# Altium project foxbms2-master.PrjPcb (part 1 of 7)
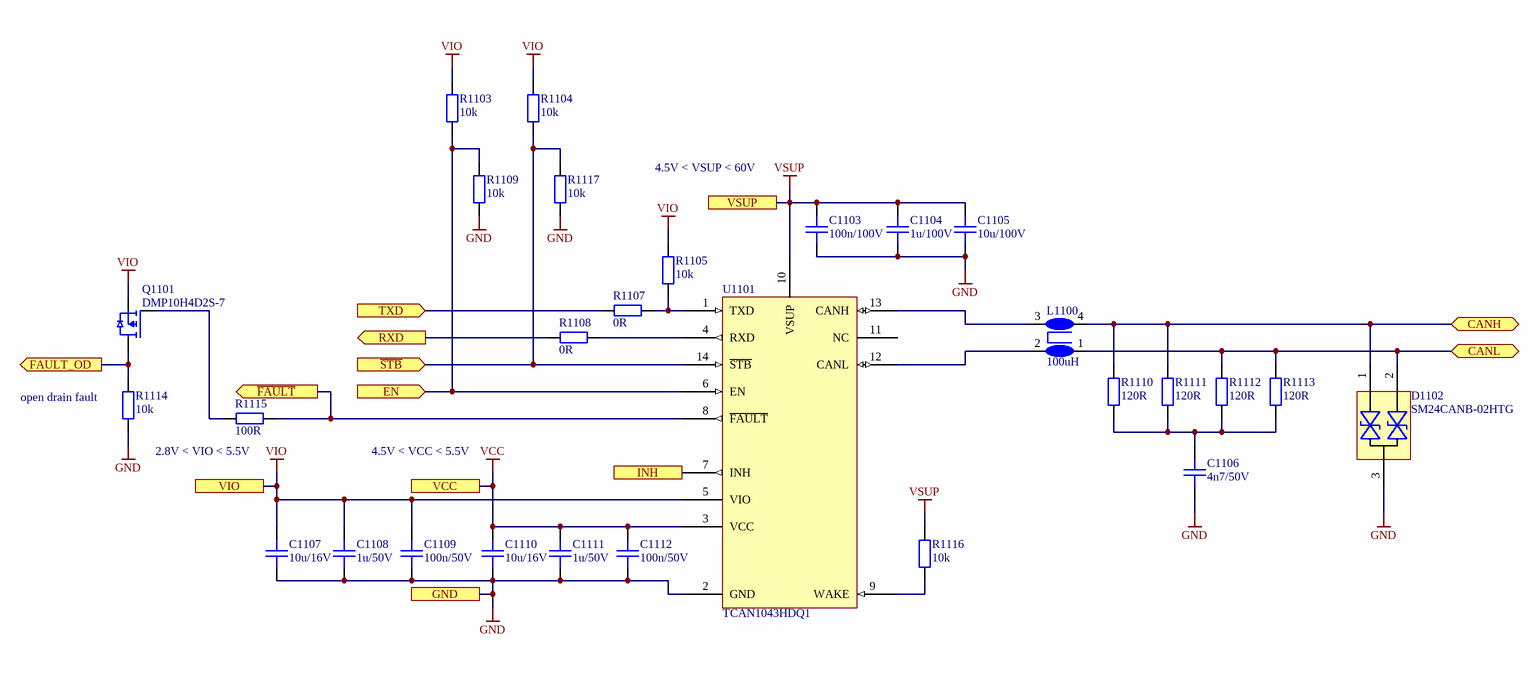
[diagram p0: can-transceiver.SchDoc]
Global_Major_Minor_Patch_Version: 1.2.3; Global_Suffix_Version: 0; GlobalDate: 2025-03-28; GlobalLicense: Creative Commons Attribution 4.0; GlobalProject: foxBMS 2 Master; GlobalVersion: ='v'+Global_Major_Minor_Patch_Version+'-'+Global_Suffix_Version
24 sheets, 379 parts. Net scope: strictly hierarchical (ports join the sheet entries above them; power ports are local).
Board file: foxbms2-master.PcbDoc
Sheets:
  can-transceiver.SchDoc
  ethernet-phy.SchDoc
  oscillator-20MHz.SchDoc
  smart-switch.SchDoc
  connectors-external-old.SchDoc
  foxbms2-master.SchDoc
    mcu = mcu.SchDoc
      mcu-com-gpio-tim = mcu-com-gpio-tim.SchDoc
      mcu-emif-etm-dmm = mcu-emif-etm-dmm.SchDoc
      mcu-adc = mcu-adc.SchDoc
    connectors-external = connectors-external.SchDoc
    connectors-internal = connectors-internal.SchDoc
    communication = communication.SchDoc
    peripherals = peripherals.SchDoc
      window-watchdog = window-watchdog.SchDoc
      rtc = rtc.SchDoc
    io-devices = io-devices.SchDoc
    supply = supply.SchDoc
      sbcs = sbcs.SchDoc
        sbc-mcu = sbc-base.SchDoc
    io-matrix = io-matrix.SchDoc
    interlock = interlock.SchDoc
    connectors-interface = connectors-interface.SchDoc
    connectors-extension = connectors-extension.SchDoc

## Sheet can-transceiver.SchDoc
size A3; DocumentNumber: 4; SheetNumber: 4; SheetTotal: 45; SheetDescription: CAN Transceiver

### Parts
C1103  100n/100V  [CAPC1608X08N]
C1104  1u/100V  [CAPC3216X18N]
C1105  10u/100V  [CAPC5750X28N]
C1106  4n7/50V  [CAPC1005X06N]
C1107  10u/16V  [CAPC2012X14N]
C1108  1u/50V  [CAPC1608X08N]
C1109  100n/50V  [CAPC1005X06N]
C1110  10u/16V  [CAPC2012X14N]
C1111  1u/50V  [CAPC1608X08N]
C1112  100n/50V  [CAPC1005X06N]
D1102  SM24CANB-02HTG  [LF_SOT23-3]
L1100  100uH  [MURATA_DLW32SH]
Q1101  DMP10H4D2S-7  [SOT95P237X110-3N]
R1103  10k  [RESC1005X04N]
R1104  10k  [RESC1005X04N]
R1105  10k  [RESC1005X04N]
R1107  0R  [RESC1005X04N]
R1108  0R  [RESC1005X04N]
R1109  10k  [RESC1005X04N]
R1110  120R  [RESC3216X06N]
R1111  120R  [RESC3216X06N]
R1112  120R  [RESC3216X06N]
R1113  120R  [RESC3216X06N]
R1114  10k  [RESC1005X04N]
R1115  100R  [RESC1005X04N]
R1116  10k  [RESC1005X04N]
R1117  10k  [RESC1005X04N]
U1101  TCAN1043HDQ1  [TI_D0014A-C01_SOIC-14]

### Ports
CANH (bidir), CANL (bidir), EN (in), FAULT_OD (out), GND, INH, RXD (out), TXD (in), VCC, VIO, VSUP, ~{FAULT} (out), ~{STB} (in)

### Nets
GND: C1103.1 C1104.1 C1105.1 C1106.1 C1107.1 C1108.1 C1109.1 C1110.1 C1111.1 C1112.1 D1102.3 R1109.1 R1114.1 R1117.1 U1101.2(GND) ; port GND
VCC: C1110.2 C1111.2 C1112.2 U1101.3(VCC) ; port VCC
VIO: C1107.2 C1108.2 C1109.2 Q1101.S R1103.2 R1104.2 R1105.2 U1101.5(VIO) ; port VIO
VSUP: C1103.2 C1104.2 C1105.2 R1116.2 U1101.10(VSUP) ; port VSUP
NetC1106_2: C1106.2 R1110.1 R1111.1 R1112.1 R1113.1
NetD1102_1: D1102.1 L1100.4 R1110.2 R1111.2 ; port CANH
NetD1102_2: D1102.2 L1100.1 R1112.2 R1113.2 ; port CANL
NetL1100_2: L1100.2 U1101.12(CANL)
NetL1100_3: L1100.3 U1101.13(CANH)
NetQ1101_D: Q1101.D R1114.2 ; port FAULT_OD
NetQ1101_G: Q1101.G R1115.1
NetR1103_1: R1103.1 R1109.2 U1101.6(EN) ; port EN
NetR1104_1: R1104.1 R1117.2 U1101.14(~{STB}) ; port ~{STB}
NetR1105_1: R1105.1 R1107.2 U1101.1(TXD)
NetR1107_1: R1107.1 ; port TXD
NetR1108_1: R1108.1 ; port RXD
NetR1108_2: R1108.2 U1101.4(RXD)
NetR1115_2: R1115.2 U1101.8(~{FAULT}) ; port ~{FAULT}
NetR1116_1: R1116.1 U1101.9(WAKE)
NetU1101_7: U1101.7(INH) ; port INH

Not connected (* = marked no-connect by the designer): U1101 11(NC)

### Notes on the sheet
- 4.5V < VSUP < 60V
- (near R1114) open drain fault
- 2.8V < VIO < 5.5V
- 4.5V < VCC < 5.5V
- Fraunhofer IISB
- Schottkystr. 10
- developed by:
- 91058 Erlangen
- Germany
- Author
- Project
- License
- Description
- File
- Version
- Release Date
- Sheet
- foxbms.org <https://foxbms.org>
- www.iisb.fraunhofer.de <https://www.iisb.fraunhofer.de/>
- foxBMS Team
- /

### Library data of the parts
C1103 = gen_C_ceramic_100n_100V_X7R_0603: MLCC; Capacitance: 100n; Rated Voltage: 100V; Dielectric: X7R; Case EIA: 0603; Case Metric: 1608; Automotive Qualified: True; PnP Package: 0603C; Part Number: gen_C_ceramic_100n_100V_X7R_0603; Supplier 1: Digikey; Supplier Part Number 1: 490-13420-1-ND; Supplier 2: Mouser; Supplier Part Number 2: 81-GCJ188R72A104KA1D
C1104 = gen_C_ceramic_1u_100V_X7R_1206: MLCC; Capacitance: 1u; Rated Voltage: 100V; Dielectric: X7R; Case EIA: 1206; Case Metric: 3216; AVT Set: x; Automotive Qualified: True; Part Number: gen_C_ceramic_1u_100V_X7R_1206; Supplier 1: Farnell; Supplier Part Number 1: 1833855
C1105 = gen_C_ceramic_10u_100V_X7S_2220: MLCC; Capacitance: 10u; Rated Voltage: 100V; Dielectric: X7S; Case EIA: 2220; Case Metric: 5750; Automotive Qualified: True; AEC-Q Grade: Grade 0; AEC-Q Norm: AEC-Q200; Part Number: gen_C_ceramic_10u_100V_X7S_2220; Supplier 1: Digikey; Supplier Part Number 1: 445-13152-1-ND; ECCN: EAR99
C1106 = gen_C_ceramic_4n7_50V_X7R_0402: MLCC; Capacitance: 4n7; Rated Voltage: 50V; Dielectric: X7R; Case EIA: 0402; Case Metric: 1005; Automotive Qualified: True; AEC-Q Grade: Grade 1; AEC-Q Norm: AEC-Q200; PnP Package: 0402C; Part Number: gen_C_ceramic_4n7_50V_X7R_0402; ECCN: EAR99; Supplier 1: Digikey; Supplier Part Number 1: 490-14739-1-ND
C1107 C1110 = gen_C_ceramic_10u_16V_X7R_0805: MLCC; Capacitance: 10u; Rated Voltage: 16V; Dielectric: X7S; Case EIA: 0805; Case Metric: 2012; Automotive Qualified: True; AEC-Q Grade: Grade 1; AEC-Q Norm: AEC-Q200; Part Number: gen_C_ceramic_10u_16V_X7R_0805; ECCN: EAR99; Supplier 1: Digikey; Supplier Part Number 1: 445-16110-1-ND
C1108 C1111 = gen_C_ceramic_1u_50V_X7R_0603: MLCC; Capacitance: 1u; Rated Voltage: 50V; Dielectric: X7R; Case EIA: 0603; Case Metric: 1608; Automotive Qualified: False; Tolerance: ± 10%; PnP Package: 0603C; Part Number: gen_C_ceramic_1u_50V_X7R_0603; Operating Temperature: -55°C - +125°C; Supplier 1: Farnell; Supplier Part Number 1: 2779055
C1109 C1112 = gen_C_ceramic_100n_50V_X7R_0402: MLCC; Capacitance: 100n; Rated Voltage: 50V; Dielectric: X7R; Case EIA: 0402; Case Metric: 1005; PnP Package: 0402C; PnP Value: 100nF/50V/X7R; PnP equipped: x; Automotive Qualified: True; AEC-Q Norm: AEC-Q200; Part Number: gen_C_ceramic_100n_50V_X7R_0402; Supplier 1: Farnell; Supplier Part Number 1: 2210822; ECCN: EAR99
D1102 = SM24CANB-02HTG: CAN ESD Protection Diode Array; Manufacturer: Littelfuse; Automotive Qualified: True; Part Number: SM24CANB-02HTG; Part Name: SM24CANB-02HTG; Operating Temperature: -40°C - +125°C; ComponentLink1Description: Datasheet; ComponentLink1URL: https://www.littelfuse.com/~/media/electronics/datasheets/tvs_diode_arrays/littelfuse_tvs_diode_array_sm24canb_datasheet.pdf.pdf; Supplier 1: Digikey; Supplier Part Number 1: F6707CT-ND
L1100 = DLW32SH101XF2L: Common Mode Choke; Manufacturer: Murata; Rated Current: 0.115A; Automotive Qualified: True; AEC-Q Norm: AEC-Q200; Part Number: DLW32SH101XF2L; Operating Temperature: –40°C - +125°C; ComponentLink1Description: Datasheet; ComponentLink1URL: https://4donline.ihs.com/images/VipMasterIC/IC/MURE/MURE-S-A0010901825/MURE-S-A0010900222-1.pdf?hkey=6D3A4C79FDBF58556ACFDE234799DDF0; Inductance: 100uH; Supplier 1: Farnell; Supplier Part Number 1: 3639227
Q1101 = DMP10H4D2S-7: MOSFET-Transistor, p-Kanal, 0.27 A, 100 V, 4.2 ohm; Manufacturer: Diodes; Maximum Drain-Source Voltage: 100V; Maximum Continous Drain Current (25°C): 0.27A; R_DS(on): 4.2; Total Gate Charge: 1.8nC; Automotive Qualified: True; Part Number: DMP10H4D2S-7; Part Name: PMOS; Operating Temperature: -55°C - +150°C; ComponentLink1Description: Datasheet; ComponentLink1URL: https://www.diodes.com/assets/Datasheets/DMP10H4D2S.pdf; Supplier 1: Farnell; Supplier Part Number 1: 3127354; Supplier 2: Digikey; Supplier Part Number 2: DMP10H4D2S-7DICT-ND; Supplier 3: Mouser; Supplier Part Number 3: 621-DMP10H4D2S-7
R1103-R1105 R1109 R1114 R1117 = gen_R_10k_0402: SMD Resistor 10k 0402; Tolerance: 1%; Power: 0.063W; Case EIA: 0402; Case Metric: 1005; Maximum Working Voltage: 50V; PnP Package: 0402R; PnP equipped: x; Automotive Qualified: True; AEC-Q Norm: AEC-Q200; Part Number: gen_R_10k_0402; Operating Temperature: -55°C - +155°C; Resistance: 10k; Series: E24, E96; PnP Value: 10k; Supplier 1: Farnell; Supplier Part Number 1: 2059239; ECCN: EAR99
R1107 R1108 = gen_R_0R_0402: SMD Resistor 0R 0402; Power: 0.063W; Case EIA: 0402; Case Metric: 1005; Maximum Working Voltage: 50V; PnP Package: 0402R; Automotive Qualified: True; AEC-Q Norm: AEC-Q200; PnP equipped: x; Part Number: gen_R_0R_0402; Operating Temperature: -55°C - +155°C; Resistance: 0R; Series: Jumper; PnP Value: 0R; Supplier 1: Farnell; Supplier Part Number 1: 1469661; Supplier 2: Farnell; Supplier Part Number 2: 2059190; ECCN: EAR99
R1110-R1113 = gen_R_120R_1206: SMD Resistor 120R 1206; Tolerance: 1%; Power: 0.3W; Case EIA: 1206; Case Metric: 3216; Maximum Working Voltage: 200V; PnP Package: 1206R; Automotive Qualified: True; AEC-Q Grade: Grade 0; AEC-Q Norm: AEC-Q200; Part Number: gen_R_120R_1206; Operating Temperature: -55°C - +155°C; Resistance: 120R; Series: E24; PnP Value: 120R; ECCN: EAR99; Supplier 1: Digikey; Supplier Part Number 1: A129799CT-ND
R1115 = gen_R_100R_0402: SMD Resistor 100R 0402; Tolerance: 1%; Power: 0.063W; Case EIA: 0402; Case Metric: 1005; Maximum Working Voltage: 50V; PnP Package: 0402R; PnP equipped: x; Automotive Qualified: True; AEC-Q Norm: AEC-Q200; Part Number: gen_R_100R_0402; Operating Temperature: -55°C - +155°C; Resistance: 100R; Series: E24, E96; PnP Value: 100R; Supplier 1: Farnell; Supplier Part Number 1: 2302528; ECCN: EAR99
R1116 = gen_R_10k_0402: SMD Resistor 10k 0402; Tolerance: 1%; Power: 0.063W; Case EIA: 0402; Case Metric: 1005; Maximum Working Voltage: 50V; PnP Package: 0402R; Automotive Qualified: True; PnP equipped: x; AEC-Q Norm: AEC-Q200; Part Number: gen_R_10k_0402; Operating Temperature: -55°C - +155°C; Resistance: 10k; Series: E24, E96; PnP Value: 10k; Supplier 1: Farnell; Supplier Part Number 1: 2059239; ECCN: EAR99
U1101 = TCAN1043HDQ1: Low-Power Fault Protected CAN Transceiver with CAN FD and Wake; Manufacturer: Texas Instruments; PnP Package: SOIC-14; Automotive Qualified: True; AEC-Q Norm: AEC-Q100; AEC-Q Grade: Grade 1; Part Number: TCAN1043HDQ1; Part Name: TCAN1043HDQ1; Operating Temperature: −55°C - +125°C; ComponentLink1Description: Datasheet; ComponentLink1URL: https://www.ti.com/lit/ds/symlink/tcan1043h-q1.pdf?HQS=dis-mous-null-mousermode-dsf-pf-null-wwe&DCM=yes&ref_url=https%3A%2F%2Fwww.mouser.de%2F&distId=26; Supplier 1: Mouser; Supplier Part Number 1: 595-TCAN1043HDQ1; Supplier 2: Digikey; Supplier Part Number 2: 296-47920-ND; ECCN: EAR99

## Sheet ethernet-phy.SchDoc
size A3; DocumentNumber: 7; SheetNumber: 7; SheetTotal: 45; SheetDescription: Ethernet PHY
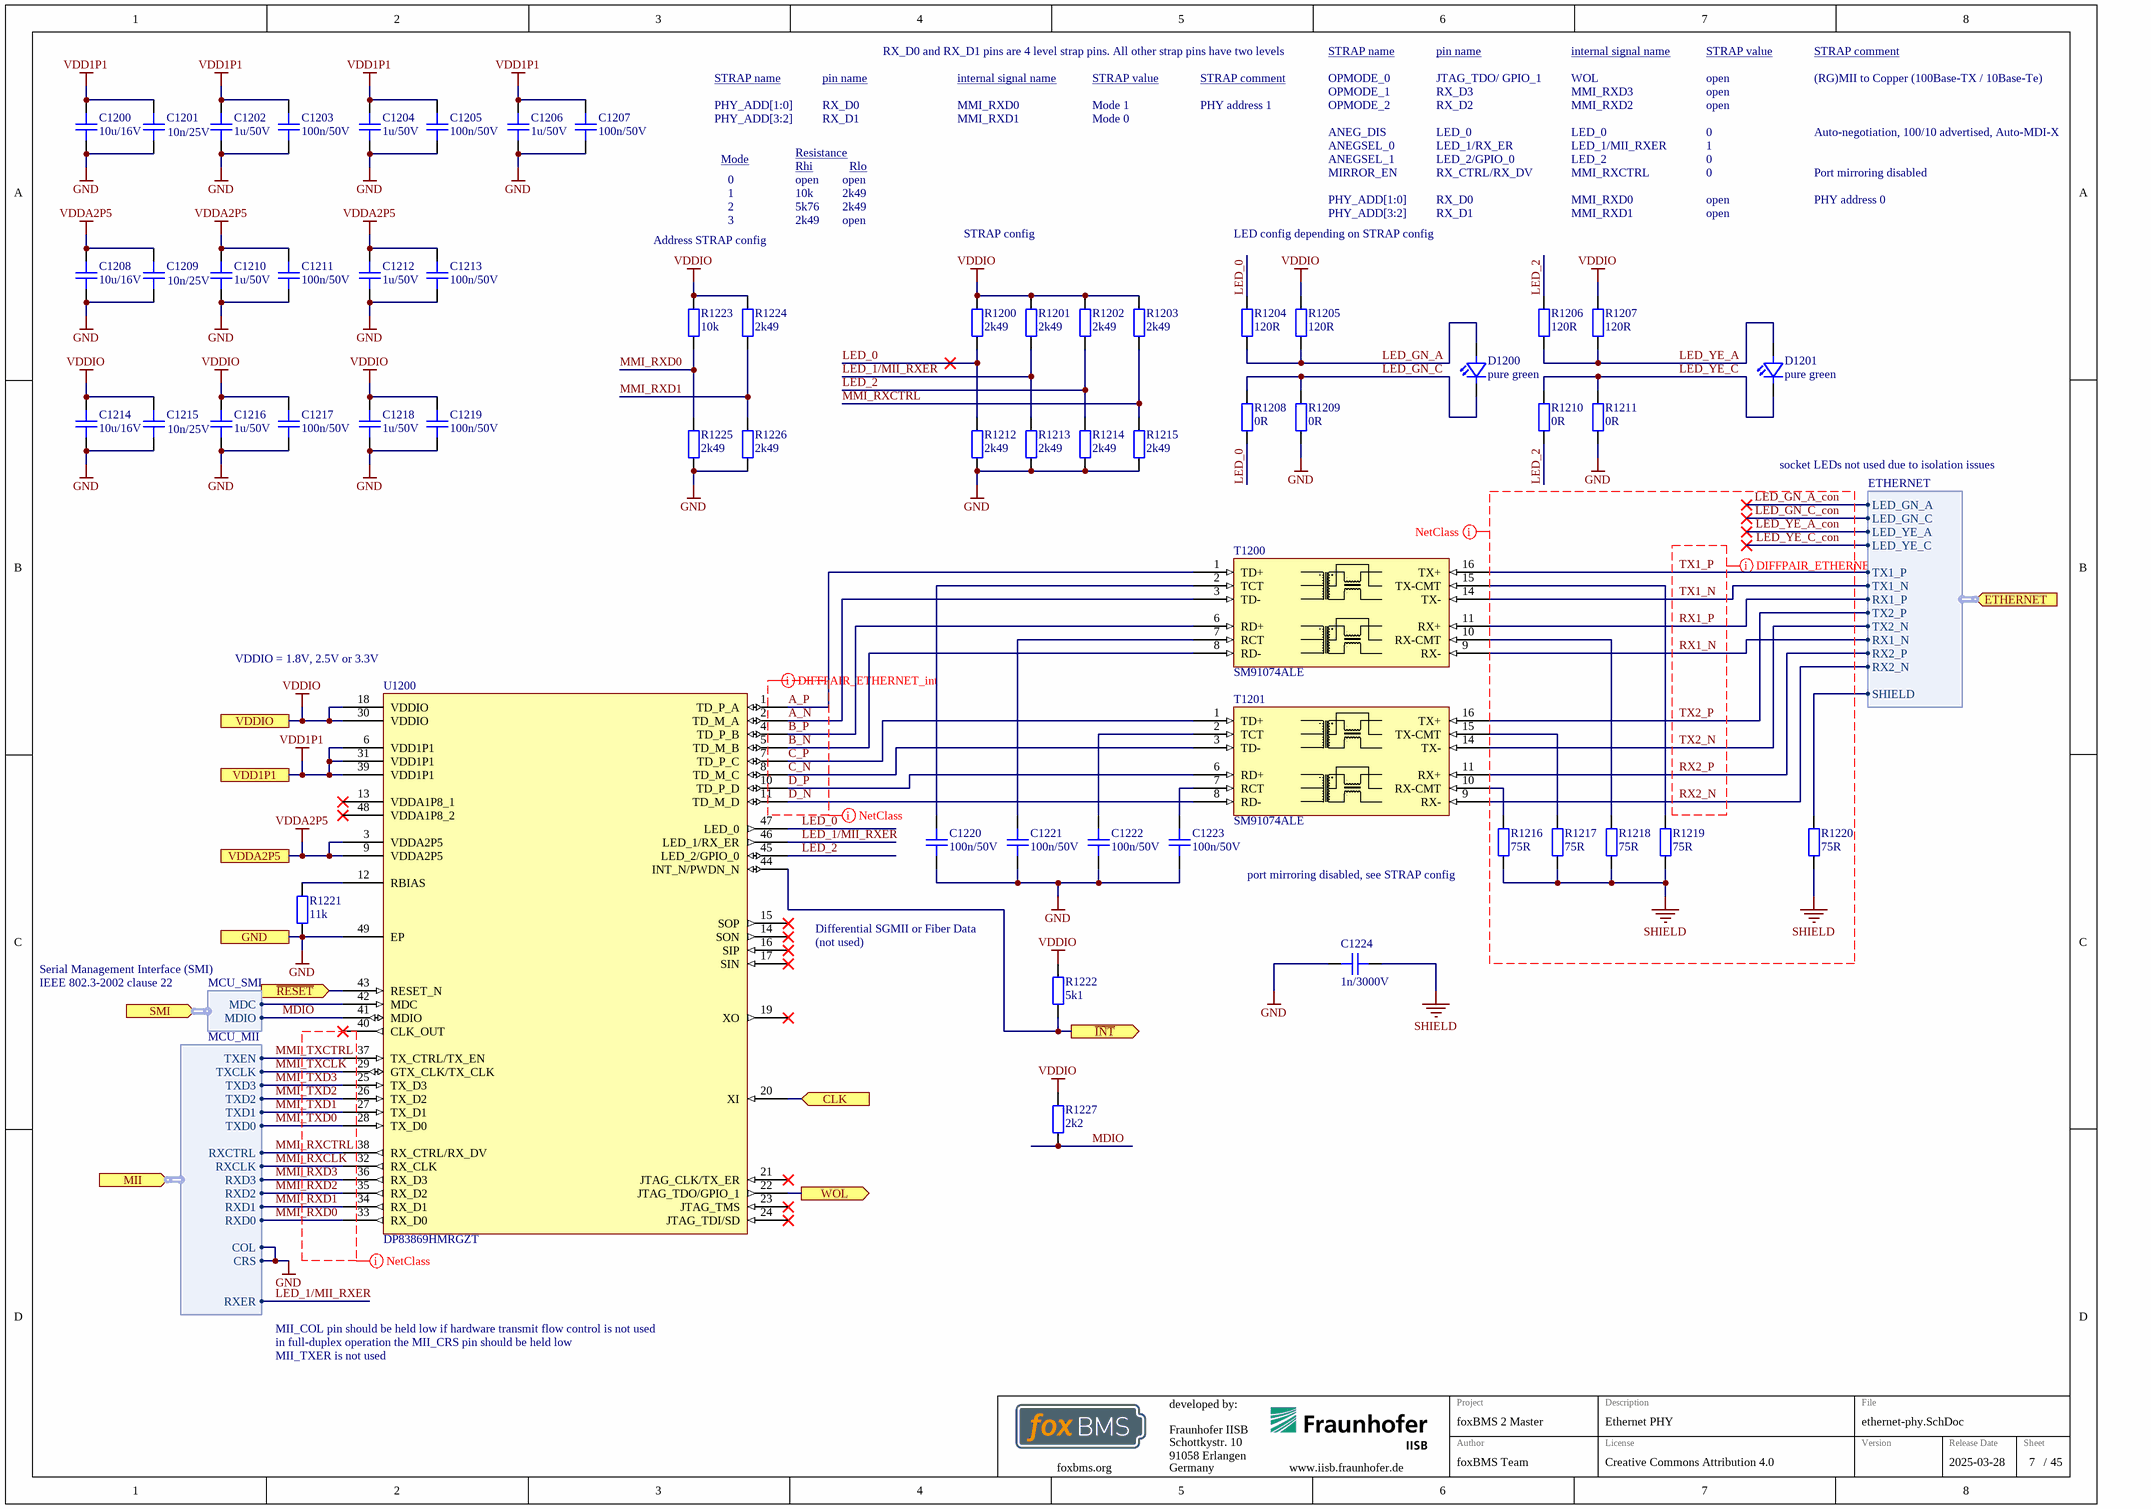
[diagram p1: ethernet-phy.SchDoc]

### Parts
C1200  10u/16V  [CAPC2012X14N]
C1201  10n/25V  [CAPC1005X06N]
C1202  1u/50V  [CAPC1608X08N]
C1203  100n/50V  [CAPC1005X06N]
C1204  1u/50V  [CAPC1608X08N]
C1205  100n/50V  [CAPC1005X06N]
C1206  1u/50V  [CAPC1608X08N]
C1207  100n/50V  [CAPC1005X06N]
C1208  10u/16V  [CAPC2012X14N]
C1209  10n/25V  [CAPC1005X06N]
C1210  1u/50V  [CAPC1608X08N]
C1211  100n/50V  [CAPC1005X06N]
C1212  1u/50V  [CAPC1608X08N]
C1213  100n/50V  [CAPC1005X06N]
C1214  10u/16V  [CAPC2012X14N]
C1215  10n/25V  [CAPC1005X06N]
C1216  1u/50V  [CAPC1608X08N]
C1217  100n/50V  [CAPC1005X06N]
C1218  1u/50V  [CAPC1608X08N]
C1219  100n/50V  [CAPC1005X06N]
C1220  100n/50V  [CAPC1005X06N]
C1221  100n/50V  [CAPC1005X06N]
C1222  100n/50V  [CAPC1005X06N]
C1223  100n/50V  [CAPC1005X06N]
C1224  1n/3000V  [CAPC2220(5750)230_N]
D1200  pure green  [LEDC1608X07N]
D1201  pure green  [LEDC1608X07N]
R1200  2k49  [RESC1005X04N]
R1201  2k49  [RESC1005X04N]
R1202  2k49  [RESC1005X04N]
R1203  2k49  [RESC1005X04N]
R1204  120R  [RESC1005X04N]
R1205  120R  [RESC1005X04N]
R1206  120R  [RESC1005X04N]
R1207  120R  [RESC1005X04N]
R1208  0R  [RESC1005X04N]
R1209  0R  [RESC1005X04N]
R1210  0R  [RESC1005X04N]
R1211  0R  [RESC1005X04N]
R1212  2k49  [RESC1005X04N]
R1213  2k49  [RESC1005X04N]
R1214  2k49  [RESC1005X04N]
R1215  2k49  [RESC1005X04N]
R1216  75R  [RESC1005X04N]
R1217  75R  [RESC1005X04N]
R1218  75R  [RESC1005X04N]
R1219  75R  [RESC1005X04N]
R1220  75R  [RESC1005X04N]
R1221  11k  [RESC1005X04N]
R1222  5k1  [RESC1005X04N]
R1223  10k  [RESC1005X04N]
R1224  2k49  [RESC1005X04N]
R1225  2k49  [RESC1005X04N]
R1226  2k49  [RESC1005X04N]
R1227  2k2  [RESC1005X04N]
T1200  SM91074ALE  [SM91074ALE]
T1201  SM91074ALE  [SM91074ALE]
U1200  DP83869HMRGZT  [DP83869HM-RGZ]

### Ports
CLK (in), ETHERNET (in, harness ETHERNET), GND, MII (in, harness MCU_MII), SMI (in, harness MCU_SMI), VDD1P1, VDDA2P5, VDDIO, WOL (out), ~{INT} (out), ~{RESET} (in)

### Harnesses
MCU_MII: TXD3, TXD2, TXD1, TXD0, TXEN, TXCLK, RXCTRL, RXCLK, RXD3, RXD2, RXD0, RXD1, RXER, COL, CRS
MCU_SMI: MDC, MDIO
ETHERNET: TX1_P, TX1_N, RX1_P, TX2_P, TX2_N, RX1_N, RX2_P, RX2_N, SHIELD, LED_YE_C, LED_YE_A, LED_GN_C, LED_GN_A

### Nets
GND: C1200.1 C1201.1 C1202.1 C1203.1 C1204.1 C1205.1 C1206.1 C1207.1 C1208.1 C1209.1 C1210.1 C1211.1 C1212.1 C1213.1 C1214.1 C1215.1 C1216.1 C1217.1 C1218.1 C1219.1 C1220.1 C1221.1 C1222.1 C1223.1 C1224.1 R1209.1 R1211.1 R1212.1 R1213.1 R1214.1 R1215.1 R1221.1 R1225.1 R1226.1 U1200.49(EP) ; port GND, port MII.COL, port MII.CRS
SHIELD: C1224.2 R1216.1 R1217.1 R1218.1 R1219.1 R1220.1
VDD1P1: C1200.2 C1201.2 C1202.2 C1203.2 C1204.2 C1205.2 C1206.2 C1207.2 U1200.6(VDD1P1) U1200.31(VDD1P1) U1200.39(VDD1P1) ; port VDD1P1
VDDA2P5: C1208.2 C1209.2 C1210.2 C1211.2 C1212.2 C1213.2 U1200.3(VDDA2P5) U1200.9(VDDA2P5) ; port VDDA2P5
VDDIO: C1214.2 C1215.2 C1216.2 C1217.2 C1218.2 C1219.2 R1200.2 R1201.2 R1202.2 R1203.2 R1205.2 R1207.2 R1222.2 R1223.2 R1224.2 R1227.2 U1200.18(VDDIO) U1200.30(VDDIO) ; port VDDIO
A_N: T1200.3(TD-) U1200.2(TD_M_A)  [project net A_N_7]
A_P: T1200.1(TD+) U1200.1(TD_P_A)  [project net A_P_7]
B_N: T1200.8(RD-) U1200.5(TD_M_B)  [project net B_N_7]
B_P: T1200.6(RD+) U1200.4(TD_P_B)  [project net B_P_7]
C_N: T1201.3(TD-) U1200.8(TD_M_C)  [project net C_N_7]
C_P: T1201.1(TD+) U1200.7(TD_P_C)  [project net C_P_7]
D_N: T1201.8(RD-) U1200.11(TD_M_D)  [project net D_N_7]
D_P: T1201.6(RD+) U1200.10(TD_P_D)  [project net D_P_7]
LED_0: R1200.1 R1204.2 R1208.1 R1212.2 U1200.47(LED_0)  [project net LED_0_7]
LED_1/MII_RXER: R1201.1 R1213.2 U1200.46(LED_1/RX_ER) ; port MII.RXER
LED_2: R1202.1 R1206.2 R1210.1 R1214.2 U1200.45(LED_2/GPIO_0)  [project net LED_2_7]
LED_GN_A: D1200.2(A) R1204.1 R1205.1  [project net LED_GN_A_7]
LED_GN_A_con: port ETHERNET.LED_GN_A
LED_GN_C: D1200.1(C) R1208.2 R1209.2  [project net LED_GN_C_7]
LED_GN_C_con: port ETHERNET.LED_GN_C
LED_YE_A: D1201.2(A) R1206.1 R1207.1  [project net LED_YE_A_7]
LED_YE_A_con: port ETHERNET.LED_YE_A
LED_YE_C: D1201.1(C) R1210.2 R1211.2  [project net LED_YE_C_7]
LED_YE_C_con: port ETHERNET.LED_YE_C
MDIO: R1227.1 U1200.41(MDIO) ; port SMI.MDIO
MMI_RXCLK: U1200.32(RX_CLK) ; port MII.RXCLK
MMI_RXCTRL: R1203.1 R1215.2 U1200.38(RX_CTRL/RX_DV) ; port MII.RXCTRL
MMI_RXD0: R1223.1 R1225.2 U1200.33(RX_D0) ; port MII.RXD0
MMI_RXD1: R1224.1 R1226.2 U1200.34(RX_D1) ; port MII.RXD1
MMI_RXD2: U1200.35(RX_D2) ; port MII.RXD2
MMI_RXD3: U1200.36(RX_D3) ; port MII.RXD3
MMI_TXCLK: U1200.29(GTX_CLK/TX_CLK) ; port MII.TXCLK
MMI_TXCTRL: U1200.37(TX_CTRL/TX_EN) ; port MII.TXEN
MMI_TXD0: U1200.28(TX_D0) ; port MII.TXD0
MMI_TXD1: U1200.27(TX_D1) ; port MII.TXD1
MMI_TXD2: U1200.26(TX_D2) ; port MII.TXD2
MMI_TXD3: U1200.25(TX_D3) ; port MII.TXD3
RX1_N: T1200.9(RX-) ; port ETHERNET.RX1_N
RX1_P: T1200.11(RX+) ; port ETHERNET.RX1_P
RX2_N: T1201.9(RX-) ; port ETHERNET.RX2_N
RX2_P: T1201.11(RX+) ; port ETHERNET.RX2_P
TX1_N: T1200.14(TX-) ; port ETHERNET.TX1_N
TX1_P: T1200.16(TX+) ; port ETHERNET.TX1_P
TX2_N: T1201.14(TX-) ; port ETHERNET.TX2_N
TX2_P: T1201.16(TX+) ; port ETHERNET.TX2_P
NetC1220_2: C1220.2 T1200.2(TCT)
NetC1221_2: C1221.2 T1200.7(RCT)
NetC1222_2: C1222.2 T1201.2(TCT)
NetC1223_2: C1223.2 T1201.7(RCT)
NetR1216_2: R1216.2 T1201.10(RX-CMT)
NetR1217_2: R1217.2 T1201.15(TX-CMT)
NetR1218_2: R1218.2 T1200.10(RX-CMT)
NetR1219_2: R1219.2 T1200.15(TX-CMT)
NetR1220_2: R1220.2 ; port ETHERNET.SHIELD
NetR1221_2: R1221.2 U1200.12(RBIAS)
NetR1222_1: R1222.1 U1200.44(INT_N/PWDN_N) ; port ~{INT}
NetU1200_20: U1200.20(XI) ; port CLK
NetU1200_22: U1200.22(JTAG_TDO/GPIO_1) ; port WOL
NetU1200_42: U1200.42(MDC) ; port SMI.MDC
NetU1200_43: U1200.43(RESET_N) ; port ~{RESET}

Not connected (* = marked no-connect by the designer): U1200 13(VDDA1P8_1)* 14(SON)* 15(SOP)* 16(SIP)* 17(SIN)* 19(XO)* 21(JTAG_CLK/TX_ER)* 23(JTAG_TMS)* 24(JTAG_TDI/SD)* 40(CLK_OUT)* 48(VDDA1P8_2)*

### Layout directives
differential pair; rule Differential Pairs Routing [Pref Gap = 12.5mil    Min Gap  = 6mil    Max Gap  = 12.5milPref Width = 6mil    Min Width  = 4mil    Max Width  = 10mil]: A_N, A_P, B_N, B_P, C_N, C_P, D_N, D_P, RX1_N, RX1_P, RX2_N, RX2_P, TX1_N, TX1_P, TX2_N, TX2_P
net class ETHERNET_EXT: LED_GN_A_con, LED_GN_C_con, LED_YE_A_con, LED_YE_C_con, RX1_N, RX1_P, RX2_N, RX2_P, SHIELD, TX1_N, TX1_P, TX2_N, TX2_P
net class MCU_MII: (no net found under the mark)
net class ETHERNET_INT: A_N, A_P, B_N, B_P, C_N, C_P, D_N, D_P

### Notes on the sheet
- PHY_ADD[1:0]
- STRAP name
- RX_D0
- pin name
- RX_D0 and RX_D1 pins are 4 level strap pins. All other strap pins have two levels
- MMI_RXD0
- internal signal name
- Mode 1
- STRAP value
- PHY address 1
- STRAP comment
- OPMODE_0
- OPMODE_1
- OPMODE_2
- JTAG_TDO/ GPIO_1
- RX_D3
- RX_D2
- WOL
- MMI_RXD3
- MMI_RXD2
- open
- (RG)MII to Copper (100Base-TX / 10Base-Te)
- PHY_ADD[3:2]
- Mode
- 0
- Resistance
- Rhi
- RX_D1
- Rlo
- MMI_RXD1
- Mode 0
- ANEG_DIS
- ANEGSEL_0
- ANEGSEL_1
- MIRROR_EN
- LED_0
- LED_1/RX_ER
- LED_2/GPIO_0
- RX_CTRL/RX_DV
- LED_1/MII_RXER
- LED_2
- MMI_RXCTRL
- 1
- Auto-negotiation, 100/10 advertised, Auto-MDI-X
- Port mirroring disabled
- Address STRAP config
- 2
- 3
- 10k
- 5k76
- 2k49
- STRAP config
- LED config depending on STRAP config
- PHY address 0
- socket LEDs not used due to isolation issues
- (near U1200) VDDIO = 1.8V, 2.5V or 3.3V
- (near R1216) port mirroring disabled, see STRAP config
- Serial Management Interface (SMI)
- IEEE 802.3-2002 clause 22
- Differential SGMII or Fiber Data
- (not used)
- MII_COL pin should be held low if hardware transmit flow control is not used
- in full-duplex operation the MII_CRS pin should be held low
- MII_TXER is not used
- Fraunhofer IISB
- Schottkystr. 10
- developed by:
- 91058 Erlangen
- Germany
- Author
- Project
- License
- Description
- File
- Version
- Release Date
- Sheet
- foxbms.org <https://foxbms.org>
- www.iisb.fraunhofer.de <https://www.iisb.fraunhofer.de/>
- foxBMS Team
- /

### Library data of the parts
C1200 C1208 C1214 = gen_C_ceramic_10u_16V_X7R_0805: as C1107 on sheet can-transceiver; Part Number: gen_C_ceramic_10u_16V_X7R_0805; ECCN: EAR99; Supplier 1: Digikey; Supplier Part Number 1: 445-16110-1-ND
C1201 C1209 C1215 = gen_C_ceramic_10n_25V_X7R_0402: MLCC; Capacitance: 10n; Rated Voltage: 25V; Dielectric: X7R; Case EIA: 0402; Case Metric: 1005; PnP Package: 0402C; PnP Value: 10nF/25V/X7R; PnP equipped: x; Automotive Qualified: True; Part Number: gen_C_ceramic_10n_25V_X7R_0402; Supplier 1: Farnell; Supplier Part Number 1: 2210793
C1202 C1204 C1206 C1210 C1212 C1216 C1218 = gen_C_ceramic_1u_50V_X7R_0603: MLCC; Capacitance: 1u; Rated Voltage: 50V; Dielectric: X7R; Tolerance: ± 10%; Case EIA: 0603; Case Metric: 1608; Automotive Qualified: False; PnP Package: 0603C; Part Number: gen_C_ceramic_1u_50V_X7R_0603; Operating Temperature: -55°C - +125°C; Supplier 1: Farnell; Supplier Part Number 1: 2779055
C1203 C1205 C1207 C1211 C1213 C1217 C1219-C1223 = gen_C_ceramic_100n_50V_X7R_0402: as C1109 on sheet can-transceiver; Part Number: gen_C_ceramic_100n_50V_X7R_0402; Supplier 1: Farnell; Supplier Part Number 1: 2210822; ECCN: EAR99
C1224 = gen_C_ceramic_1n_3000V_X7R_2220: MLCC; Capacitance: 1n; Rated Voltage: 3000V; Dielectric: X7R; Case EIA: 2220; Case Metric: 5750; Automotive Qualified: True; AEC-Q Norm: AEC-Q200; AEC-Q Grade: Grade 0; Part Number: gen_C_ceramic_1n_3000V_X7R_2220; Supplier 1: Digikey; Supplier Part Number 1: 399-16803-1-ND; ECCN: EAR99
D1200 D1201 = LED_0603_pure_green_AECQ: TLMP1100-GS08; Manufacturer: Vishay; Breakdown Voltage: 5V; Continuous Forward Current: 20mA; Forward Voltage @ 20mA: 2.1V; Automotive Qualified: True; Part Number: LED_0603_pure_green_AECQ; Color: pure green; Operating Temperature: -40°C - 100°C; ComponentLink1Description: Datasheet; ComponentLink1URL: http://www.farnell.com/datasheets/2049164.pdf; Supplier 1: Farnell; Supplier Part Number 1: 1328306; Supplier 2: Digikey; Supplier Part Number 2: 751-1176-1-ND; PnP Package: LED_0603
R1200-R1203 R1212-R1215 R1224-R1226 = gen_R_2k49_0402: SMD Resistor 2k49 0402; Tolerance: 1%; Power: 0.063W; Case EIA: 0402; Case Metric: 1005; Maximum Working Voltage: 50V; PnP Package: 0402R; Automotive Qualified: True; Part Number: gen_R_2k49_0402; Operating Temperature: -55°C - +155°C; Resistance: 2k49; Series: E96; PnP Value: 2k49; Supplier 1: Farnell; Supplier Part Number 1: 2059135
R1204-R1207 = gen_R_120R_0402: SMD Resistor 120R 0402; Tolerance: 1%; Power: 0.063W; Case EIA: 0402; Case Metric: 1005; Maximum Working Voltage: 50V; PnP Package: 0402R; Automotive Qualified: True; AEC-Q Norm: AEC-Q200; Part Number: gen_R_120R_0402; Operating Temperature: -55°C - +155°C; Resistance: 120R; Series: E24; PnP Value: 120R; Supplier 1: Farnell; Supplier Part Number 1: 2302535; ECCN: EAR99
R1208-R1211 = gen_R_0R_0402: as R1107 on sheet can-transceiver; Part Number: gen_R_0R_0402; Operating Temperature: -55°C - +155°C; Resistance: 0R; Series: Jumper; PnP Value: 0R; Supplier 1: Farnell; Supplier Part Number 1: 1469661; Supplier 2: Farnell; Supplier Part Number 2: 2059190; ECCN: EAR99
R1216-R1220 = gen_R_75R_0402: SMD Resistor 75R 0402; Tolerance: 1%; Power: 0.063W; Case EIA: 0402; Case Metric: 1005; Maximum Working Voltage: 50V; PnP Package: 0402R; Automotive Qualified: True; AEC-Q Norm: AEC-Q200; AEC-Q Grade: Grade 0; Part Number: gen_R_75R_0402; Operating Temperature: -55°C - +155°C; Resistance: 75R; Series: E24, E96; PnP Value: 75R; ECCN: EAR99; Supplier 1: Farnell; Supplier Part Number 1: 2059111
R1221 = gen_R_11k_0402: SMD Resistor 11k 0402; Tolerance: 1%; Power: 0.063W; Case EIA: 0402; Case Metric: 1005; Maximum Working Voltage: 50V; PnP Package: 0402R; Automotive Qualified: True; AEC-Q Norm: AEC-Q200; Part Number: gen_R_11k_0402; Operating Temperature: -55°C - +155°C; Resistance: 11k; Series: E24, E96; PnP Value: 11k; ECCN: EAR99; Supplier 1: Farnell; Supplier Part Number 1: 2324762
R1222 = gen_R_5k1_0402: SMD Resistor 5k1 0402; Tolerance: 1%; Power: 0.063W; Case EIA: 0402; Case Metric: 1005; Maximum Working Voltage: 50V; PnP Package: 0402R; Automotive Qualified: True; PnP equipped: x; AEC-Q Norm: AEC-Q200; AEC-Q Grade: Grade 0; Part Number: gen_R_5k1_0402; Operating Temperature: -55°C - +155°C; Resistance: 5k1; Series: E24; PnP Value: 5k1; Supplier 1: Farnell; Supplier Part Number 1: 2302709; ECCN: EAR99
R1223 = gen_R_10k_0402: as R1103 on sheet can-transceiver; Part Number: gen_R_10k_0402; Operating Temperature: -55°C - +155°C; Resistance: 10k; Series: E24, E96; PnP Value: 10k; Supplier 1: Farnell; Supplier Part Number 1: 2059239; ECCN: EAR99
R1227 = gen_R_2k2_0402: SMD Resistor 2k2 0402; Tolerance: 1%; Power: 0.063W; Case EIA: 0402; Case Metric: 1005; Maximum Working Voltage: 50V; PnP Package: 0402R; PnP equipped: x; Automotive Qualified: True; AEC-Q Norm: AEC-Q200; Part Number: gen_R_2k2_0402; Operating Temperature: -55°C - +155°C; Resistance: 2k2; Series: E24; PnP Value: 2k2; Supplier 1: Farnell; Supplier Part Number 1: 4136977
T1200 T1201 = SM91074ALE: 10/100 Base-T Transformer; Manufacturer: Bourns; Automotive Qualified: True; Part Number: SM91074ALE; Part Name: SM91074ALE; Operating Temperature: −40°C - +125°C; ComponentLink1Description: Datasheet; ComponentLink1URL: https://datasheet.octopart.com/SM91074ALE-Bourns-datasheet-134093235.pdf; Supplier 1: Farnell; Supplier Part Number 1: 2932105; Supplier 2: Mouser; Supplier Part Number 2: 652-SM91074ALE; Supplier 3: Digikey; Supplier Part Number 3: SM91074ALECT-ND
U1200 = DP83869HMRGZT: High Immunity 10/100/1000 Ethernet Physical Layer Transceiver and Fiber Interface; Manufacturer: Texas Instruments; PnP Package: VQFN-48; Automotive Qualified: False; Part Number: DP83869HMRGZT; Part Name: DP83869HMRGZT; Operating Temperature: −40°C - +125°C; ComponentLink1Description: Datasheet; ComponentLink1URL: http://www.ti.com/lit/ds/symlink/dp83869hm.pdf; Supplier 1: Digikey; Supplier Part Number 1: 296-53377-1-ND; Supplier 2: Mouser; Supplier Part Number 2: 595-DP83869HMRGZT

## Sheet oscillator-20MHz.SchDoc
size A3; DocumentNumber: 30; SheetNumber: 30; SheetTotal: 45; SheetDescription: Oscillator
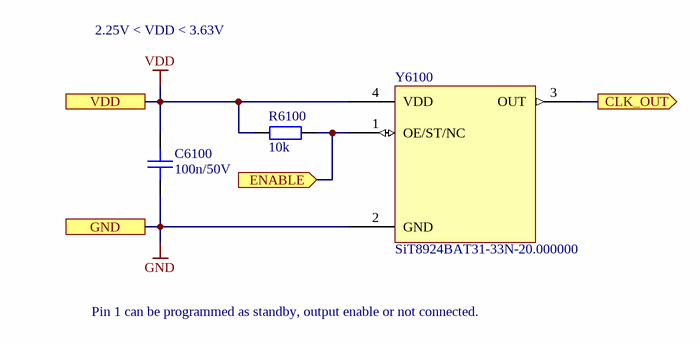
[diagram p2: oscillator-20MHz.SchDoc]

### Parts
C6100  100n/50V  [CAPC1005X06N]
R6100  10k  [RESC1005X04N]
Y6100  SiT8924BAT31-33N-20.000000  [SiT8924xx-3x]

### Ports
CLK_OUT (out), ENABLE (in), GND, VDD

### Nets
GND: C6100.1 Y6100.2(GND) ; port GND
VDD: C6100.2 R6100.1 Y6100.4(VDD) ; port VDD
NetR6100_2: R6100.2 Y6100.1(OE/ST/NC) ; port ENABLE
NetY6100_3: Y6100.3(OUT) ; port CLK_OUT

### Notes on the sheet
- 2.25V < VDD < 3.63V
- Pin 1 can be programmed as standby, output enable or not connected.
- Fraunhofer IISB
- Schottkystr. 10
- developed by:
- 91058 Erlangen
- Germany
- Author
- Project
- License
- Description
- File
- Version
- Release Date
- Sheet
- foxbms.org <https://foxbms.org>
- www.iisb.fraunhofer.de <https://www.iisb.fraunhofer.de/>
- foxBMS Team
- /

### Library data of the parts
C6100 = gen_C_ceramic_100n_50V_X7R_0402: as C1109 on sheet can-transceiver; Part Number: gen_C_ceramic_100n_50V_X7R_0402; Supplier 1: Farnell; Supplier Part Number 1: 2210822; ECCN: EAR99
R6100 = gen_R_10k_0402: as R1103 on sheet can-transceiver; Part Number: gen_R_10k_0402; Operating Temperature: -55°C - +155°C; Resistance: 10k; Series: E24, E96; PnP Value: 10k; Supplier 1: Farnell; Supplier Part Number 1: 2059239; ECCN: EAR99
Y6100 = SiT8924BAT31-33N-20.000000: Automotive AEC-Q100 Oscillator 20MHz; Manufacturer: SiTime; Automotive Qualified: True; AEC-Q Grade: Grade 0; Part Number: SiT8924BAT31-33N-20.000000; Part Name: SiT8924BAT31-33N-20.000000; Operating Temperature: -55°C - +125°C; ComponentLink1Description: Datasheet; ComponentLink1URL: https://www.sitime.com/datasheet/SiT8924; AEC-Q Norm: AEC-Q100; ECCN: EAR99

## Sheet smart-switch.SchDoc
size A3; DocumentNumber: 20; SheetNumber: 20; SheetTotal: 45; SheetDescription: Smart high-side switch
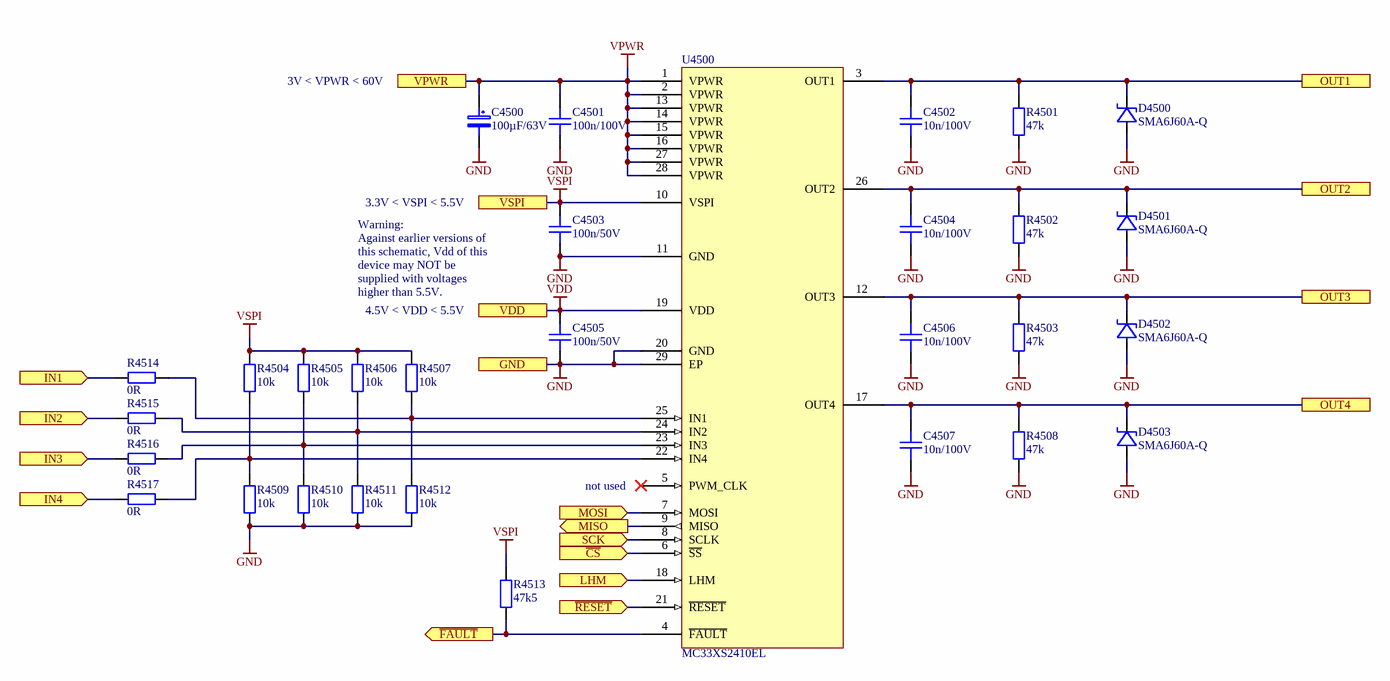
[diagram p3: smart-switch.SchDoc]

### Parts
C4500  100µF/63V  [ELECTROLYTIC_CAP_PANASONIC_G]
C4501  100n/100V  [CAPC1608X08N]
C4502  10n/100V  [CAPC1608X08N]
C4503  100n/50V  [CAPC1005X06N]
C4504  10n/100V  [CAPC1608X08N]
C4505  100n/50V  [CAPC1005X06N]
C4506  10n/100V  [CAPC1608X08N]
C4507  10n/100V  [CAPC1608X08N]
D4500  SMA6J60A-Q  [BOURNS_DO-214AC_SMA]
D4501  SMA6J60A-Q  [BOURNS_DO-214AC_SMA]
D4502  SMA6J60A-Q  [BOURNS_DO-214AC_SMA]
D4503  SMA6J60A-Q  [BOURNS_DO-214AC_SMA]
R4501  47k  [RESC1005X04N]
R4502  47k  [RESC1005X04N]
R4503  47k  [RESC1005X04N]
R4504  10k  [RESC1005X04N]
R4505  10k  [RESC1005X04N]
R4506  10k  [RESC1005X04N]
R4507  10k  [RESC1005X04N]
R4508  47k  [RESC1005X04N]
R4509  10k  [RESC1005X04N]
R4510  10k  [RESC1005X04N]
R4511  10k  [RESC1005X04N]
R4512  10k  [RESC1005X04N]
R4513  47k5  [RESC1005X04N]
R4514  0R  [RESC1005X04N]
R4515  0R  [RESC1005X04N]
R4516  0R  [RESC1005X04N]
R4517  0R  [RESC1005X04N]
U4500  MC33XS2410EL  [MC33XS2410EL]

### Ports
GND, IN1 (in), IN2 (in), IN3 (in), IN4 (in), LHM (in), MISO (out), MOSI (in), OUT1, OUT2, OUT3, OUT4, SCK (in), VDD, VPWR, VSPI, ~{CS} (in), ~{FAULT} (out), ~{RESET} (in)

### Nets
GND: C4500.2 C4501.1 C4502.1 C4503.1 C4504.1 C4505.1 C4506.1 C4507.1 D4500.2(A) D4501.2(A) D4502.2(A) D4503.2(A) R4501.1 R4502.1 R4503.1 R4508.1 R4509.1 R4510.1 R4511.1 R4512.1 U4500.11(GND) U4500.20(GND) U4500.29(EP) ; port GND
VDD: C4505.2 U4500.19(VDD) ; port VDD
VPWR: C4500.1 C4501.2 U4500.1(VPWR) U4500.2(VPWR) U4500.13(VPWR) U4500.14(VPWR) U4500.15(VPWR) U4500.16(VPWR) U4500.27(VPWR) U4500.28(VPWR) ; port VPWR
VSPI: C4503.2 R4504.2 R4505.2 R4506.2 R4507.2 R4513.2 U4500.10(VSPI) ; port VSPI
NetC4502_2: C4502.2 D4500.1(C) R4501.2 U4500.3(OUT1) ; port OUT1
NetC4504_2: C4504.2 D4501.1(C) R4502.2 U4500.26(OUT2) ; port OUT2
NetC4506_2: C4506.2 D4502.1(C) R4503.2 U4500.12(OUT3) ; port OUT3
NetC4507_2: C4507.2 D4503.1(C) R4508.2 U4500.17(OUT4) ; port OUT4
NetR4504_1: R4504.1 R4509.2 R4517.2 U4500.22(IN4)
NetR4505_1: R4505.1 R4510.2 R4516.2 U4500.23(IN3)
NetR4506_1: R4506.1 R4511.2 R4515.2 U4500.24(IN2)
NetR4507_1: R4507.1 R4512.2 R4514.2 U4500.25(IN1)
NetR4513_1: R4513.1 U4500.4(~{FAULT}) ; port ~{FAULT}
NetR4514_1: R4514.1 ; port IN1
NetR4515_1: R4515.1 ; port IN2
NetR4516_1: R4516.1 ; port IN3
NetR4517_1: R4517.1 ; port IN4
NetU4500_6: U4500.6(~{SS}) ; port ~{CS}
NetU4500_7: U4500.7(MOSI) ; port MOSI
NetU4500_8: U4500.8(SCLK) ; port SCK
NetU4500_9: U4500.9(MISO) ; port MISO
NetU4500_18: U4500.18(LHM) ; port LHM
NetU4500_21: U4500.21(~{RESET}) ; port ~{RESET}

Not connected (* = marked no-connect by the designer): U4500 5(PWM_CLK)*

### Notes on the sheet
- 3V < VPWR < 60V
- 3.3V < VSPI < 5.5V
- Warning:
  Against earlier versions of this schematic, Vdd of this device may NOT be supplied with voltages higher than 5.5V.
- 4.5V < VDD < 5.5V
- not used
- Fraunhofer IISB
- Schottkystr. 10
- developed by:
- 91058 Erlangen
- Germany
- Author
- Project
- License
- Description
- File
- Version
- Release Date
- Sheet
- foxbms.org <https://foxbms.org>
- www.iisb.fraunhofer.de <https://www.iisb.fraunhofer.de/>
- foxBMS Team
- /

### Library data of the parts
C4500 = EEE-TG1J101UP: SMD Electrolytic Capacitor; Capacitance: 100µF; Rated Voltage: 63V; Tolerance: +-20%; Heigth: 10.5mm; Automotive Qualified: True; Part Number: EEE-TG1J101UP; Operating Temperature: -40°C to 125°C; Diameter: 10mm; ComponentLink1Description: Datasheet; ComponentLink1URL: https://industrial.panasonic.com/cdbs/www-data/pdf/RDE0000/ABA0000C1187.pdf; Supplier 1: Digikey; Supplier Part Number 1: PCE4086CT-ND
C4501 = gen_C_ceramic_100n_100V_X7R_0603: as C1103 on sheet can-transceiver; Part Number: gen_C_ceramic_100n_100V_X7R_0603; Supplier 1: Digikey; Supplier Part Number 1: 490-13420-1-ND; Supplier 2: Mouser; Supplier Part Number 2: 81-GCJ188R72A104KA1D
C4502 C4504 C4506 C4507 = gen_C_ceramic_10n_100V_X7R_0603: MLCC; Capacitance: 10n; Rated Voltage: 100V; Dielectric: X7R; Case EIA: 0603; Case Metric: 1608; PnP Package: 0603C; PnP Value: 10nF/100V/X7R; Automotive Qualified: True; AEC-Q Norm: AEC-Q200; Part Number: gen_C_ceramic_10n_100V_X7R_0603; Supplier 1: Farnell; Supplier Part Number 1: 1301715; Supplier 2: Farnell; Supplier Part Number 2: 2821192; Supplier 3: Farnell; Supplier Part Number 3: 2210878; ECCN: EAR99
C4503 C4505 = gen_C_ceramic_100n_50V_X7R_0402: as C1109 on sheet can-transceiver; Part Number: gen_C_ceramic_100n_50V_X7R_0402; Supplier 1: Farnell; Supplier Part Number 1: 2210822; ECCN: EAR99
D4500-D4503 = SMA6J60A-Q: TVS-Diode DO-214AC (SMA); Manufacturer: Bourns; Breakdown Voltage: 60V; Automotive Qualified: True; AEC-Q Norm: AEC-Q101; AEC-Q Grade: Grade 0; Part Number: SMA6J60A-Q; Part Name: SMA6J60A-Q; Operating Temperature: -55°C - +150°C; ComponentLink1Description: Datasheet; ComponentLink1URL: https://www.mouser.de/datasheet/2/54/sma6j_q-1919913.pdf; Supplier 1: Mouser; Supplier Part Number 1: 652-SMA6J60A-Q; ECCN: EAR99
R4501-R4503 R4508 = gen_R_47k_0402: SMD Resistor 47k 0402; Tolerance: 1%; Power: 0.063W; Case EIA: 0402; Case Metric: 1005; Maximum Working Voltage: 50V; PnP Package: 0402R; PnP equipped: x; Automotive Qualified: True; AEC-Q Norm: AEC-Q200; AEC-Q Grade: Grade 0; Part Number: gen_R_47k_0402; Operating Temperature: -55°C - +155°C; Resistance: 47k; Series: E24; PnP Value: 47k; Supplier 1: Digikey; Supplier Part Number 1: A129647CT-ND; ECCN: EAR99
R4504-R4507 R4509-R4512 = gen_R_10k_0402: as R1103 on sheet can-transceiver; Part Number: gen_R_10k_0402; Operating Temperature: -55°C - +155°C; Resistance: 10k; Series: E24, E96; PnP Value: 10k; Supplier 1: Farnell; Supplier Part Number 1: 2059239; ECCN: EAR99
R4513 = gen_R_47k5_0402: SMD Resistor 47k5 0402; Tolerance: 1%; Power: 0.063W; Case EIA: 0402; Case Metric: 1005; Maximum Working Voltage: 50V; PnP Package: 0402R; Automotive Qualified: True; AEC-Q Grade: Grade 0; AEC-Q Norm: AEC-Q200; Part Number: gen_R_47k5_0402; Operating Temperature: -55°C - +155°C; Resistance: 47k5; Series: E96; PnP Value: 47k5; ECCN: EAR99; Supplier 1: Farnell; Supplier Part Number 1: 2563598
R4514-R4517 = gen_R_0R_0402: as R1107 on sheet can-transceiver; Part Number: gen_R_0R_0402; Operating Temperature: -55°C - +155°C; Resistance: 0R; Series: Jumper; PnP Value: 0R; Supplier 1: Farnell; Supplier Part Number 1: 1469661; Supplier 2: Farnell; Supplier Part Number 2: 2059190; ECCN: EAR99
U4500 = MC33XS2410EL: Quad 100 mΩ / dual 50 mΩ, 3.0 V to 60 V high-side switch; Manufacturer: NXP; PnP Package: HTSSOP-28; Automotive Qualified: True; Part Number: MC33XS2410EL; Part Name: MC33XS2410EL; Operating Temperature: −40°C - +125°C

## Sheet connectors-external-old.SchDoc
size A3; DocumentNumber: 11; SheetNumber: 11; SheetTotal: 45; SheetDescription: Connectors (external)
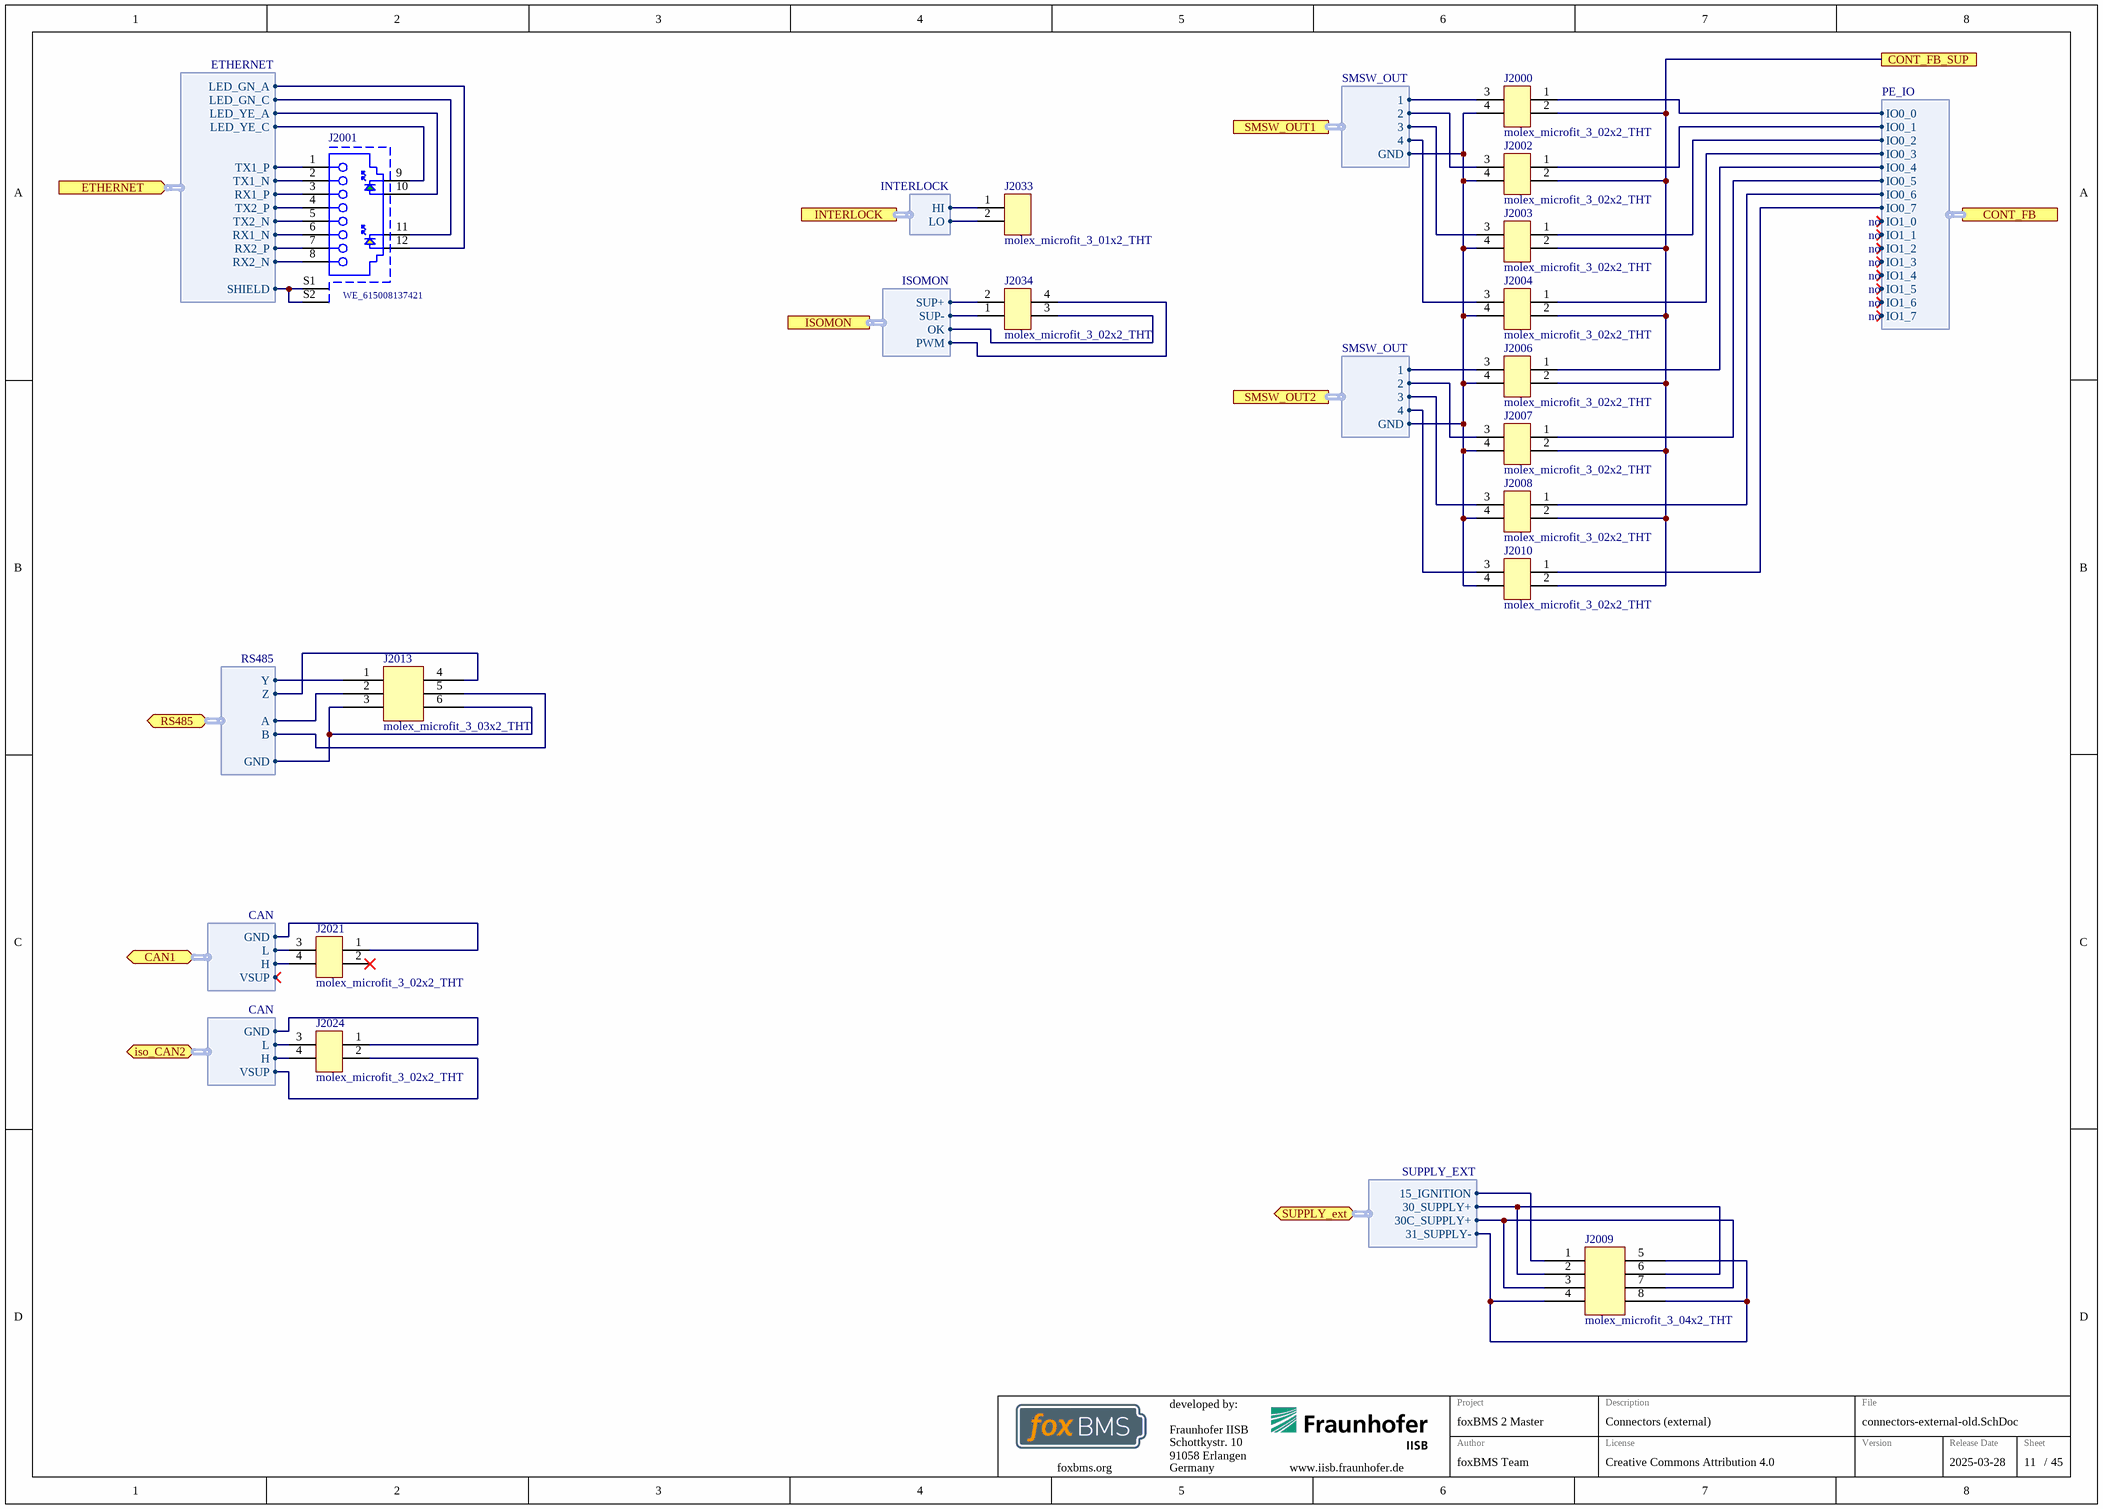
[diagram p4: connectors-external-old.SchDoc]

### Parts
(Parts that share a designator on the sheet are numbered #1, #2 ... from top to bottom, then left to right.)
J2000#1  molex_microfit_3_02x2_THT  [MOLEX_MICROFIT_02x2_THT]
J2001  WE_615008137421  [WE_615008137421]
J2002#1  molex_microfit_3_02x2_THT  [MOLEX_MICROFIT_02x2_THT]
J2003#1  molex_microfit_3_02x2_THT  [MOLEX_MICROFIT_02x2_THT]
J2004#1  molex_microfit_3_02x2_THT  [MOLEX_MICROFIT_02x2_THT]
J2006#1  molex_microfit_3_02x2_THT  [MOLEX_MICROFIT_02x2_THT]
J2007#1  molex_microfit_3_02x2_THT  [MOLEX_MICROFIT_02x2_THT]
J2008#1  molex_microfit_3_02x2_THT  [MOLEX_MICROFIT_02x2_THT]
J2009#1  molex_microfit_3_04x2_THT  [MOLEX_MICROFIT_04x2_THT]
J2010#1  molex_microfit_3_02x2_THT  [MOLEX_MICROFIT_02x2_THT]
J2013#1  molex_microfit_3_03x2_THT  [MOLEX_MICROFIT_03x2_THT]
J2021#1  molex_microfit_3_02x2_THT  [MOLEX_MICROFIT_02x2_THT]
J2024#1  molex_microfit_3_02x2_THT  [MOLEX_MICROFIT_02x2_THT]
J2033#1  molex_microfit_3_01x2_THT  [MOLEX_MICROFIT_01x2_THT]
J2034#1  molex_microfit_3_02x2_THT  [MOLEX_MICROFIT_02x2_THT]

### Ports
CAN1 (bidir, harness CAN), CONT_FB (harness PE_IO), CONT_FB_SUP, ETHERNET (in, harness ETHERNET), INTERLOCK (harness INTERLOCK), iso_CAN2 (bidir, harness CAN), ISOMON (harness ISOMON), RS485 (bidir, harness RS485), SMSW_OUT1 (harness SMSW_OUT), SMSW_OUT2 (harness SMSW_OUT), SUPPLY_ext (bidir, harness SUPPLY_EXT)

### Harnesses
RS485: Y, Z, A, B, GND
SMSW_OUT: 1, 2, 3, 4, GND
PE_IO: IO0_0, IO0_1, IO0_2, IO0_3, IO0_4, IO0_5, IO0_6, IO0_7, IO1_0, IO1_1, IO1_2, IO1_3, IO1_4, IO1_5, IO1_6, IO1_7
ISOMON: SUP+, SUP-, OK, PWM
CAN: H, L, GND, VSUP
INTERLOCK: HI, LO
ETHERNET: TX1_P, TX1_N, RX1_P, TX2_P, TX2_N, RX1_N, RX2_P, RX2_N, SHIELD, LED_YE_C, LED_YE_A, LED_GN_C, LED_GN_A
SUPPLY_EXT: 30_SUPPLY+, 31_SUPPLY-, 15_IGNITION, 30C_SUPPLY+

### Nets
NetJ2000#1_1: J2000#1.1 ; port CONT_FB.IO0_0
NetJ2000#1_2: J2000#1.2 J2002#1.2 J2003#1.2 J2004#1.2 J2006#1.2 J2007#1.2 J2008#1.2 J2010#1.2 ; port CONT_FB_SUP
NetJ2000#1_3: J2000#1.3 ; port SMSW_OUT1.1
NetJ2000#1_4: J2000#1.4 J2002#1.4 J2003#1.4 J2004#1.4 J2006#1.4 J2007#1.4 J2008#1.4 J2010#1.4 ; port SMSW_OUT1.GND, port SMSW_OUT2.GND
NetJ2001_1: J2001.1 ; port ETHERNET.TX1_P
NetJ2001_2: J2001.2 ; port ETHERNET.TX1_N
NetJ2001_3: J2001.3 ; port ETHERNET.RX1_P
NetJ2001_4: J2001.4 ; port ETHERNET.TX2_P
NetJ2001_5: J2001.5 ; port ETHERNET.TX2_N
NetJ2001_6: J2001.6 ; port ETHERNET.RX1_N
NetJ2001_7: J2001.7 ; port ETHERNET.RX2_P
NetJ2001_8: J2001.8 ; port ETHERNET.RX2_N
NetJ2001_9: J2001.9 ; port ETHERNET.LED_YE_C
NetJ2001_10: J2001.10 ; port ETHERNET.LED_YE_A
NetJ2001_11: J2001.11 ; port ETHERNET.LED_GN_C
NetJ2001_12: J2001.12 ; port ETHERNET.LED_GN_A
NetJ2001_S1: J2001.S1 J2001.S2 ; port ETHERNET.SHIELD
NetJ2002#1_1: J2002#1.1 ; port CONT_FB.IO0_1
NetJ2002#1_3: J2002#1.3 ; port SMSW_OUT1.2
NetJ2003#1_1: J2003#1.1 ; port CONT_FB.IO0_2
NetJ2003#1_3: J2003#1.3 ; port SMSW_OUT1.3
NetJ2004#1_1: J2004#1.1 ; port CONT_FB.IO0_3
NetJ2004#1_3: J2004#1.3 ; port SMSW_OUT1.4
NetJ2006#1_1: J2006#1.1 ; port CONT_FB.IO0_4
NetJ2006#1_3: J2006#1.3 ; port SMSW_OUT2.1
NetJ2007#1_1: J2007#1.1 ; port CONT_FB.IO0_5
NetJ2007#1_3: J2007#1.3 ; port SMSW_OUT2.2
NetJ2008#1_1: J2008#1.1 ; port CONT_FB.IO0_6
NetJ2008#1_3: J2008#1.3 ; port SMSW_OUT2.3
NetJ2009#1_1: J2009#1.1 ; port SUPPLY_ext.15_IGNITION
NetJ2009#1_2: J2009#1.2 J2009#1.6 ; port SUPPLY_ext.30_SUPPLY+
NetJ2009#1_3: J2009#1.3 J2009#1.7 ; port SUPPLY_ext.30C_SUPPLY+
NetJ2009#1_4: J2009#1.4 J2009#1.5 J2009#1.8 ; port SUPPLY_ext.31_SUPPLY-
NetJ2010#1_1: J2010#1.1 ; port CONT_FB.IO0_7
NetJ2010#1_3: J2010#1.3 ; port SMSW_OUT2.4
NetJ2013#1_1: J2013#1.1 ; port RS485.Y
NetJ2013#1_2: J2013#1.2 ; port RS485.A
NetJ2013#1_3: J2013#1.3 J2013#1.6 ; port RS485.GND
NetJ2013#1_4: J2013#1.4 ; port RS485.Z
NetJ2013#1_5: J2013#1.5 ; port RS485.B
NetJ2021#1_1: J2021#1.1 ; port CAN1.GND
NetJ2021#1_3: J2021#1.3 ; port CAN1.L
NetJ2021#1_4: J2021#1.4 ; port CAN1.H
NetJ2024#1_1: J2024#1.1 ; port iso_CAN2.GND
NetJ2024#1_2: J2024#1.2 ; port iso_CAN2.VSUP
NetJ2024#1_3: J2024#1.3 ; port iso_CAN2.L
NetJ2024#1_4: J2024#1.4 ; port iso_CAN2.H
NetJ2033#1_1: J2033#1.1 ; port INTERLOCK.HI
NetJ2033#1_2: J2033#1.2 ; port INTERLOCK.LO
NetJ2034#1_1: J2034#1.1 ; port ISOMON.SUP-
NetJ2034#1_2: J2034#1.2 ; port ISOMON.SUP+
NetJ2034#1_3: J2034#1.3 ; port ISOMON.OK
NetJ2034#1_4: J2034#1.4 ; port ISOMON.PWM

Not connected (* = marked no-connect by the designer): J2021#1 2*

### Notes on the sheet
- not used
- Fraunhofer IISB
- Schottkystr. 10
- developed by:
- 91058 Erlangen
- Germany
- Author
- Project
- License
- Description
- File
- Version
- Release Date
- Sheet
- foxbms.org <https://foxbms.org>
- www.iisb.fraunhofer.de <https://www.iisb.fraunhofer.de/>
- foxBMS Team
- /

### Library data of the parts
J2000#1 J2002#1 J2003#1 J2004#1 J2006#1 J2007#1 J2008#1 J2010#1 J2021#1 J2024#1 J2034#1 = molex_microfit_3_02x2_THT: Micro-Fit 3.0 Right Angle Header, 3.00mm Pitch, Dual Row, 4 Circuits, with Snap-in Plastic Peg PCB Lock, Tin, Glow Wire Capable, Black, 43045-0400; Manufacturer: Molex; Circuits: 4; Rated Voltage: 600V; Rated Current: 8.5A; Automotive Qualified: False; Part Number: molex_microfit_3_02x2_THT; Part Name: MicroFit; Operating Temperature: -40°C - +105°C; Supplier 1: Farnell; Supplier Part Number 1: 9733019; ECCN: EAR99
J2001 = WE_615008137421: Modular Jack WR-MJ, Tab Up; Manufacturer: Würth; Pin Number: 8P8C; Port: 1x1; Entrance: Horizontal; Compliance: Lead free / RoHS; Rated Current: 1.5 A; Working Voltage: 125 VAC; Withstanding Voltage: 1000 VAC; Contact Resistance: 30 mOhm; Circuits: 12; Rated Voltage: 120V AC; Automotive Qualified: False; ComponentLink1Description: Datasheet; ComponentLink1URL: https://www.we-online.com/katalog/datasheet/615008137421.pdf; ComponentLink2Description: Datasheet; ComponentLink2URL: https://katalog.we-online.de/em/datasheet/615008185121.pdf; Part Number: WE_615008137421; Published Date: July 2018; Publisher: Wurth Elektronik; Operating Temperature: −40 °C - +85 °C; Mounting Technology: THT; Packaging: Tray; Part Name: WE_615008137421; Supplier 1: Mouser; Supplier Part Number 1: 710-615008137421; Supplier 3: Wuerth Electronics; Supplier Part Number 3: 615008137421; ECCN: EAR99
J2009#1 = molex_microfit_3_04x2_THT: Micro-Fit 3.0 Right Angle Header, 3.00mm Pitch, Dual Row, 8 Circuits, with Snap-in Plastic Peg PCB Lock, Tin, Glow Wire Capable, Black, 43045-0800; Manufacturer: Molex; Circuits: 8; Rated Voltage: 600V; Rated Current: 8.5A; Automotive Qualified: False; Part Number: molex_microfit_3_04x2_THT; Part Name: MicroFit; Operating Temperature: -40°C - +105°C; Supplier 1: Farnell; Supplier Part Number 1: 1012254; ECCN: EAR99
J2013#1 = molex_microfit_3_03x2_THT: Micro-Fit 3.0 Right Angle Header, 3.00mm Pitch, Dual Row, 6 Circuits, with Snap-in Plastic Peg PCB Lock, Tin, Glow Wire Capable, Black, 43045-0600; Manufacturer: Molex; Circuits: 6; Rated Voltage: 600V; Rated Current: 8.5A; Automotive Qualified: False; Part Number: molex_microfit_3_03x2_THT; Part Name: MicroFit; Operating Temperature: -40°C - +105°C; Supplier 1: Farnell; Supplier Part Number 1: 1012252; ECCN: EAR99
J2033#1 = molex_microfit_3_01x2_THT: Micro-Fit 3.0 Right Angle Header, 3.00mm Pitch, Dual Row, 2 Circuits, with Snap-in Plastic Peg PCB Lock, Tin, Glow Wire Capable, Black, 43045-0200; Manufacturer: Molex; Circuits: 2; Rated Voltage: 600V; Rated Current: 8.5A; Automotive Qualified: False; Part Number: molex_microfit_3_01x2_THT; Part Name: MicroFit; Operating Temperature: -40°C - +105°C; Supplier 1: Farnell; Supplier Part Number 1: 1012251; ECCN: EAR99